# EAGLE schematic panel (EAGLE 6.6.0)

## Sheet 1 of 2
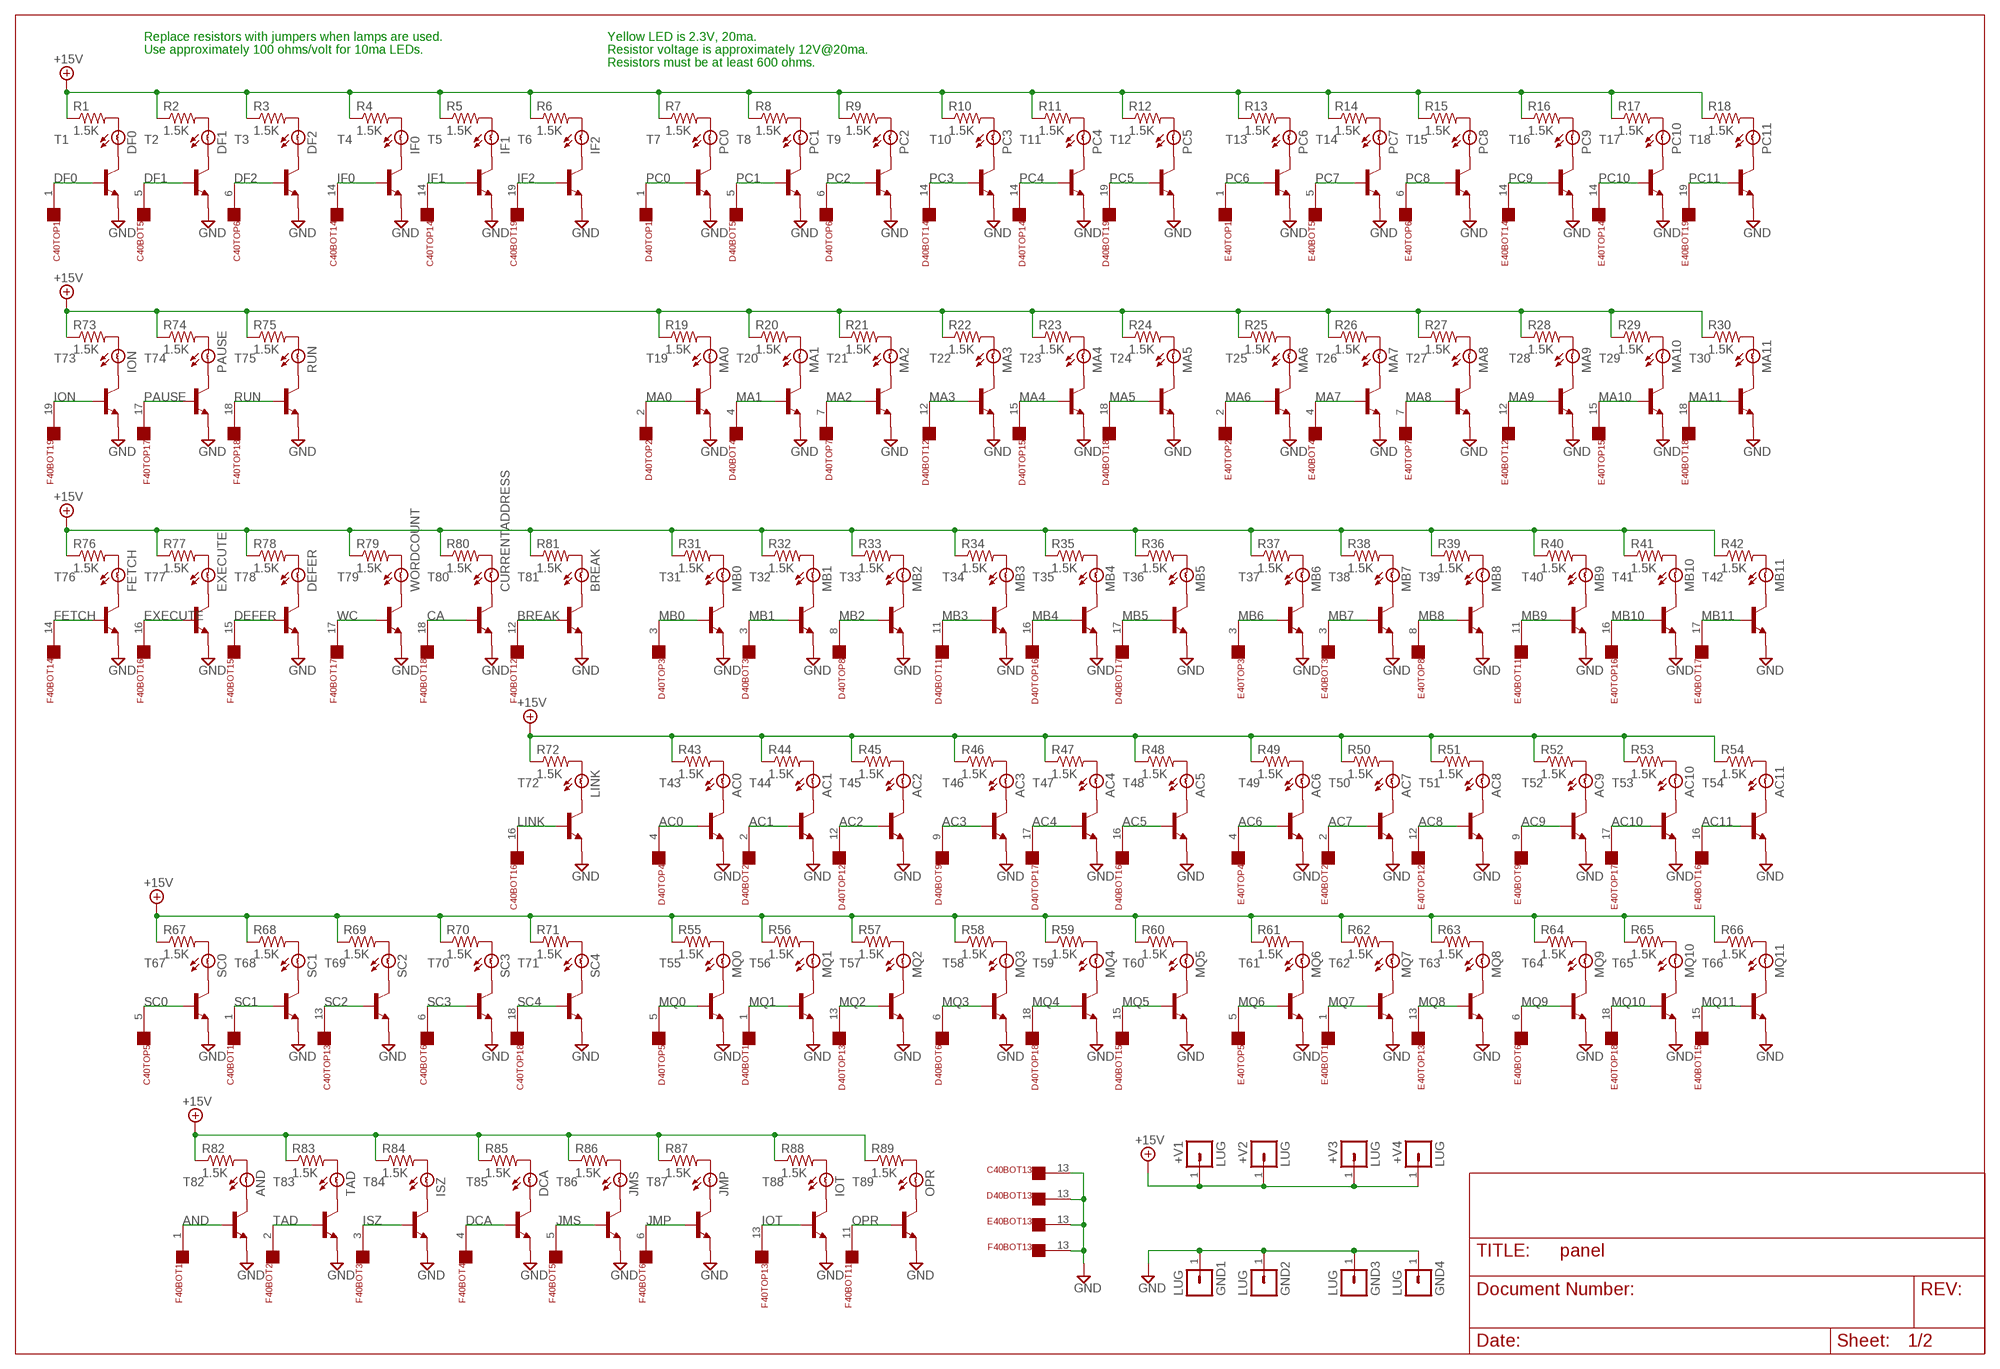
[diagram p0: schematic, sheet 1]

### Parts
+V1  LUG  [SPADELUG]
+V2  LUG  [SPADELUG]
+V3  LUG  [SPADELUG]
+V4  LUG  [SPADELUG]
AC0  BULB  [BULB]
AC1  BULB  [BULB]
AC2  BULB  [BULB]
AC3  BULB  [BULB]
AC4  BULB  [BULB]
AC5  BULB  [BULB]
AC6  BULB  [BULB]
AC7  BULB  [BULB]
AC8  BULB  [BULB]
AC9  BULB  [BULB]
AC10  BULB  [BULB]
AC11  BULB  [BULB]
AND  BULB  [BULB]
BREAK  BULB  [BULB]
C40BOT  FLEX19  [FLEX19]
C40TOP  FLEX19  [FLEX19]
CURRENTADDRESS  BULB  [BULB]
D40BOT  FLEX19  [FLEX19]
D40TOP  FLEX19  [FLEX19]
DCA  BULB  [BULB]
DEFER  BULB  [BULB]
DF0  BULB  [BULB]
DF1  BULB  [BULB]
DF2  BULB  [BULB]
E40BOT  FLEX19  [FLEX19]
E40TOP  FLEX19  [FLEX19]
EXECUTE  BULB  [BULB]
F40BOT  FLEX19  [FLEX19]
F40TOP  FLEX19  [FLEX19]
FETCH  BULB  [BULB]
GND1  LUG  [SPADELUG]
GND2  LUG  [SPADELUG]
GND3  LUG  [SPADELUG]
GND4  LUG  [SPADELUG]
IF0  BULB  [BULB]
IF1  BULB  [BULB]
IF2  BULB  [BULB]
ION  BULB  [BULB]
IOT  BULB  [BULB]
ISZ  BULB  [BULB]
JMP  BULB  [BULB]
JMS  BULB  [BULB]
LINK  BULB  [BULB]
MA0  BULB  [BULB]
MA1  BULB  [BULB]
MA2  BULB  [BULB]
MA3  BULB  [BULB]
MA4  BULB  [BULB]
MA5  BULB  [BULB]
MA6  BULB  [BULB]
MA7  BULB  [BULB]
MA8  BULB  [BULB]
MA9  BULB  [BULB]
MA10  BULB  [BULB]
MA11  BULB  [BULB]
MB0  BULB  [BULB]
MB1  BULB  [BULB]
MB2  BULB  [BULB]
MB3  BULB  [BULB]
MB4  BULB  [BULB]
MB5  BULB  [BULB]
MB6  BULB  [BULB]
MB7  BULB  [BULB]
MB8  BULB  [BULB]
MB9  BULB  [BULB]
MB10  BULB  [BULB]
MB11  BULB  [BULB]
MQ0  BULB  [BULB]
MQ1  BULB  [BULB]
MQ2  BULB  [BULB]
MQ3  BULB  [BULB]
MQ4  BULB  [BULB]
MQ5  BULB  [BULB]
MQ6  BULB  [BULB]
MQ7  BULB  [BULB]
MQ8  BULB  [BULB]
MQ9  BULB  [BULB]
MQ10  BULB  [BULB]
MQ11  BULB  [BULB]
OPR  BULB  [BULB]
PAUSE  BULB  [BULB]
PC0  BULB  [BULB]
PC1  BULB  [BULB]
PC2  BULB  [BULB]
PC3  BULB  [BULB]
PC4  BULB  [BULB]
PC5  BULB  [BULB]
PC6  BULB  [BULB]
PC7  BULB  [BULB]
PC8  BULB  [BULB]
PC9  BULB  [BULB]
PC10  BULB  [BULB]
PC11  BULB  [BULB]
R1  1.5K  R-US_0207/10  [0207/10]
R2  1.5K  R-US_0207/10  [0207/10]
R3  1.5K  R-US_0207/10  [0207/10]
R4  1.5K  R-US_0207/10  [0207/10]
R5  1.5K  R-US_0207/10  [0207/10]
R6  1.5K  R-US_0207/10  [0207/10]
R7  1.5K  R-US_0207/10  [0207/10]
R8  1.5K  R-US_0207/10  [0207/10]
R9  1.5K  R-US_0207/10  [0207/10]
R10  1.5K  R-US_0207/10  [0207/10]
R11  1.5K  R-US_0207/10  [0207/10]
R12  1.5K  R-US_0207/10  [0207/10]
R13  1.5K  R-US_0207/10  [0207/10]
R14  1.5K  R-US_0207/10  [0207/10]
R15  1.5K  R-US_0207/10  [0207/10]
R16  1.5K  R-US_0207/10  [0207/10]
R17  1.5K  R-US_0207/10  [0207/10]
R18  1.5K  R-US_0207/10  [0207/10]
R19  1.5K  R-US_0207/10  [0207/10]
R20  1.5K  R-US_0207/10  [0207/10]
R21  1.5K  R-US_0207/10  [0207/10]
R22  1.5K  R-US_0207/10  [0207/10]
R23  1.5K  R-US_0207/10  [0207/10]
R24  1.5K  R-US_0207/10  [0207/10]
R25  1.5K  R-US_0207/10  [0207/10]
R26  1.5K  R-US_0207/10  [0207/10]
R27  1.5K  R-US_0207/10  [0207/10]
R28  1.5K  R-US_0207/10  [0207/10]
R29  1.5K  R-US_0207/10  [0207/10]
R30  1.5K  R-US_0207/10  [0207/10]
R31  1.5K  R-US_0207/10  [0207/10]
R32  1.5K  R-US_0207/10  [0207/10]
R33  1.5K  R-US_0207/10  [0207/10]
R34  1.5K  R-US_0207/10  [0207/10]
R35  1.5K  R-US_0207/10  [0207/10]
R36  1.5K  R-US_0207/10  [0207/10]
R37  1.5K  R-US_0207/10  [0207/10]
R38  1.5K  R-US_0207/10  [0207/10]
R39  1.5K  R-US_0207/10  [0207/10]
R40  1.5K  R-US_0207/10  [0207/10]
R41  1.5K  R-US_0207/10  [0207/10]
R42  1.5K  R-US_0207/10  [0207/10]
R43  1.5K  R-US_0207/10  [0207/10]
R44  1.5K  R-US_0207/10  [0207/10]
R45  1.5K  R-US_0207/10  [0207/10]
R46  1.5K  R-US_0207/10  [0207/10]
R47  1.5K  R-US_0207/10  [0207/10]
R48  1.5K  R-US_0207/10  [0207/10]
R49  1.5K  R-US_0207/10  [0207/10]
R50  1.5K  R-US_0207/10  [0207/10]
R51  1.5K  R-US_0207/10  [0207/10]
R52  1.5K  R-US_0207/10  [0207/10]
R53  1.5K  R-US_0207/10  [0207/10]
R54  1.5K  R-US_0207/10  [0207/10]
R55  1.5K  R-US_0207/10  [0207/10]
R56  1.5K  R-US_0207/10  [0207/10]
R57  1.5K  R-US_0207/10  [0207/10]
R58  1.5K  R-US_0207/10  [0207/10]
R59  1.5K  R-US_0207/10  [0207/10]
R60  1.5K  R-US_0207/10  [0207/10]
R61  1.5K  R-US_0207/10  [0207/10]
R62  1.5K  R-US_0207/10  [0207/10]
R63  1.5K  R-US_0207/10  [0207/10]
R64  1.5K  R-US_0207/10  [0207/10]
R65  1.5K  R-US_0207/10  [0207/10]
R66  1.5K  R-US_0207/10  [0207/10]
R67  1.5K  R-US_0207/10  [0207/10]
R68  1.5K  R-US_0207/10  [0207/10]
R69  1.5K  R-US_0207/10  [0207/10]
R70  1.5K  R-US_0207/10  [0207/10]
R71  1.5K  R-US_0207/10  [0207/10]
R72  1.5K  R-US_0207/10  [0207/10]
R73  1.5K  R-US_0207/10  [0207/10]
R74  1.5K  R-US_0207/10  [0207/10]
R75  1.5K  R-US_0207/10  [0207/10]
R76  1.5K  R-US_0207/10  [0207/10]
R77  1.5K  R-US_0207/10  [0207/10]
R78  1.5K  R-US_0207/10  [0207/10]
R79  1.5K  R-US_0207/10  [0207/10]
R80  1.5K  R-US_0207/10  [0207/10]
R81  1.5K  R-US_0207/10  [0207/10]
R82  1.5K  R-US_0207/10  [0207/10]
R83  1.5K  R-US_0207/10  [0207/10]
R84  1.5K  R-US_0207/10  [0207/10]
R85  1.5K  R-US_0207/10  [0207/10]
R86  1.5K  R-US_0207/10  [0207/10]
R87  1.5K  R-US_0207/10  [0207/10]
R88  1.5K  R-US_0207/10  [0207/10]
R89  1.5K  R-US_0207/10  [0207/10]
RUN  BULB  [BULB]
SC0  BULB  [BULB]
SC1  BULB  [BULB]
SC2  BULB  [BULB]
SC3  BULB  [BULB]
SC4  BULB  [BULB]
T1  MPS2222A-NPN-TO92-CBE  [TO92-CBE]
T2  MPS2222A-NPN-TO92-CBE  [TO92-CBE]
T3  MPS2222A-NPN-TO92-CBE  [TO92-CBE]
T4  MPS2222A-NPN-TO92-CBE  [TO92-CBE]
T5  MPS2222A-NPN-TO92-CBE  [TO92-CBE]
T6  MPS2222A-NPN-TO92-CBE  [TO92-CBE]
T7  MPS2222A-NPN-TO92-CBE  [TO92-CBE]
T8  MPS2222A-NPN-TO92-CBE  [TO92-CBE]
T9  MPS2222A-NPN-TO92-CBE  [TO92-CBE]
T10  MPS2222A-NPN-TO92-CBE  [TO92-CBE]
T11  MPS2222A-NPN-TO92-CBE  [TO92-CBE]
T12  MPS2222A-NPN-TO92-CBE  [TO92-CBE]
T13  MPS2222A-NPN-TO92-CBE  [TO92-CBE]
T14  MPS2222A-NPN-TO92-CBE  [TO92-CBE]
T15  MPS2222A-NPN-TO92-CBE  [TO92-CBE]
T16  MPS2222A-NPN-TO92-CBE  [TO92-CBE]
T17  MPS2222A-NPN-TO92-CBE  [TO92-CBE]
T18  MPS2222A-NPN-TO92-CBE  [TO92-CBE]
T19  MPS2222A-NPN-TO92-CBE  [TO92-CBE]
T20  MPS2222A-NPN-TO92-CBE  [TO92-CBE]
T21  MPS2222A-NPN-TO92-CBE  [TO92-CBE]
T22  MPS2222A-NPN-TO92-CBE  [TO92-CBE]
T23  MPS2222A-NPN-TO92-CBE  [TO92-CBE]
T24  MPS2222A-NPN-TO92-CBE  [TO92-CBE]
T25  MPS2222A-NPN-TO92-CBE  [TO92-CBE]
T26  MPS2222A-NPN-TO92-CBE  [TO92-CBE]
T27  MPS2222A-NPN-TO92-CBE  [TO92-CBE]
T28  MPS2222A-NPN-TO92-CBE  [TO92-CBE]
T29  MPS2222A-NPN-TO92-CBE  [TO92-CBE]
T30  MPS2222A-NPN-TO92-CBE  [TO92-CBE]
T31  MPS2222A-NPN-TO92-CBE  [TO92-CBE]
T32  MPS2222A-NPN-TO92-CBE  [TO92-CBE]
T33  MPS2222A-NPN-TO92-CBE  [TO92-CBE]
T34  MPS2222A-NPN-TO92-CBE  [TO92-CBE]
T35  MPS2222A-NPN-TO92-CBE  [TO92-CBE]
T36  MPS2222A-NPN-TO92-CBE  [TO92-CBE]
T37  MPS2222A-NPN-TO92-CBE  [TO92-CBE]
T38  MPS2222A-NPN-TO92-CBE  [TO92-CBE]
T39  MPS2222A-NPN-TO92-CBE  [TO92-CBE]
T40  MPS2222A-NPN-TO92-CBE  [TO92-CBE]
T41  MPS2222A-NPN-TO92-CBE  [TO92-CBE]
T42  MPS2222A-NPN-TO92-CBE  [TO92-CBE]
T43  MPS2222A-NPN-TO92-CBE  [TO92-CBE]
T44  MPS2222A-NPN-TO92-CBE  [TO92-CBE]
T45  MPS2222A-NPN-TO92-CBE  [TO92-CBE]
T46  MPS2222A-NPN-TO92-CBE  [TO92-CBE]
T47  MPS2222A-NPN-TO92-CBE  [TO92-CBE]
T48  MPS2222A-NPN-TO92-CBE  [TO92-CBE]
T49  MPS2222A-NPN-TO92-CBE  [TO92-CBE]
T50  MPS2222A-NPN-TO92-CBE  [TO92-CBE]
T51  MPS2222A-NPN-TO92-CBE  [TO92-CBE]
T52  MPS2222A-NPN-TO92-CBE  [TO92-CBE]
T53  MPS2222A-NPN-TO92-CBE  [TO92-CBE]
T54  MPS2222A-NPN-TO92-CBE  [TO92-CBE]
T55  MPS2222A-NPN-TO92-CBE  [TO92-CBE]
T56  MPS2222A-NPN-TO92-CBE  [TO92-CBE]
T57  MPS2222A-NPN-TO92-CBE  [TO92-CBE]
T58  MPS2222A-NPN-TO92-CBE  [TO92-CBE]
T59  MPS2222A-NPN-TO92-CBE  [TO92-CBE]
T60  MPS2222A-NPN-TO92-CBE  [TO92-CBE]
T61  MPS2222A-NPN-TO92-CBE  [TO92-CBE]
T62  MPS2222A-NPN-TO92-CBE  [TO92-CBE]
T63  MPS2222A-NPN-TO92-CBE  [TO92-CBE]
T64  MPS2222A-NPN-TO92-CBE  [TO92-CBE]
T65  MPS2222A-NPN-TO92-CBE  [TO92-CBE]
T66  MPS2222A-NPN-TO92-CBE  [TO92-CBE]
T67  MPS2222A-NPN-TO92-CBE  [TO92-CBE]
T68  MPS2222A-NPN-TO92-CBE  [TO92-CBE]
T69  MPS2222A-NPN-TO92-CBE  [TO92-CBE]
T70  MPS2222A-NPN-TO92-CBE  [TO92-CBE]
T71  MPS2222A-NPN-TO92-CBE  [TO92-CBE]
T72  MPS2222A-NPN-TO92-CBE  [TO92-CBE]
T73  MPS2222A-NPN-TO92-CBE  [TO92-CBE]
T74  MPS2222A-NPN-TO92-CBE  [TO92-CBE]
T75  MPS2222A-NPN-TO92-CBE  [TO92-CBE]
T76  MPS2222A-NPN-TO92-CBE  [TO92-CBE]
T77  MPS2222A-NPN-TO92-CBE  [TO92-CBE]
T78  MPS2222A-NPN-TO92-CBE  [TO92-CBE]
T79  MPS2222A-NPN-TO92-CBE  [TO92-CBE]
T80  MPS2222A-NPN-TO92-CBE  [TO92-CBE]
T81  MPS2222A-NPN-TO92-CBE  [TO92-CBE]
T82  MPS2222A-NPN-TO92-CBE  [TO92-CBE]
T83  MPS2222A-NPN-TO92-CBE  [TO92-CBE]
T84  MPS2222A-NPN-TO92-CBE  [TO92-CBE]
T85  MPS2222A-NPN-TO92-CBE  [TO92-CBE]
T86  MPS2222A-NPN-TO92-CBE  [TO92-CBE]
T87  MPS2222A-NPN-TO92-CBE  [TO92-CBE]
T88  MPS2222A-NPN-TO92-CBE  [TO92-CBE]
T89  MPS2222A-NPN-TO92-CBE  [TO92-CBE]
TAD  BULB  [BULB]
WORDCOUNT  BULB  [BULB]

### Nets
+15V [supply]: +V1.1 +V2.1 +V3.1 +V4.1 R1.1 R2.1 R3.1 R4.1 R5.1 R6.1 R7.1 R8.1 R9.1 R10.1 R11.1 R12.1 R13.1 R14.1 R15.1 R16.1 R17.1 R18.1 R19.1 R20.1 R21.1 R22.1 R23.1 R24.1 R25.1 R26.1 R27.1 R28.1 R29.1 R30.1 R31.1 R32.1 R33.1 R34.1 R35.1 R36.1 R37.1 R38.1 R39.1 R40.1 R41.1 R42.1 R43.1 R44.1 R45.1 R46.1 R47.1 R48.1 R49.1 R50.1 R51.1 R52.1 R53.1 R54.1 R55.1 R56.1 R57.1 R58.1 R59.1 R60.1 R61.1 R62.1 R63.1 R64.1 R65.1 R66.1 R67.1 R68.1 R69.1 R70.1 R71.1 R72.1 R73.1 R74.1 R75.1 R76.1 R77.1 R78.1 R79.1 R80.1 R81.1 R82.1 R83.1 R84.1 R85.1 R86.1 R87.1 R88.1 R89.1
AC0: D40TOP.4 T43.B ; also sheet 2
AC1: D40BOT.2 T44.B ; also sheet 2
AC2: D40TOP.12 T45.B ; also sheet 2
AC3: D40BOT.9 T46.B ; also sheet 2
AC4: D40TOP.17 T47.B ; also sheet 2
AC5: D40BOT.16 T48.B ; also sheet 2
AC6: E40TOP.4 T49.B ; also sheet 2
AC7: E40BOT.2 T50.B ; also sheet 2
AC8: E40TOP.12 T51.B ; also sheet 2
AC9: E40BOT.9 T52.B ; also sheet 2
AC10: E40TOP.17 T53.B ; also sheet 2
AC11: E40BOT.16 T54.B ; also sheet 2
AND: F40BOT.1 T82.B ; also sheet 2
BREAK: F40BOT.12 T81.B ; also sheet 2
CA: F40BOT.18 T80.B ; also sheet 2
DCA: F40BOT.4 T85.B ; also sheet 2
DEFER: F40BOT.15 T78.B ; also sheet 2
DF0: C40TOP.1 T1.B ; also sheet 2
DF1: C40BOT.5 T2.B ; also sheet 2
DF2: C40TOP.6 T3.B ; also sheet 2
EXECUTE: F40BOT.16 T77.B ; also sheet 2
FETCH: F40BOT.14 T76.B ; also sheet 2
GND [supply]: C40BOT.13 D40BOT.13 E40BOT.13 F40BOT.13 GND1.1 GND2.1 GND3.1 GND4.1 T1.E T2.E T3.E T4.E T5.E T6.E T7.E T8.E T9.E T10.E T11.E T12.E T13.E T14.E T15.E T16.E T17.E T18.E T19.E T20.E T21.E T22.E T23.E T24.E T25.E T26.E T27.E T28.E T29.E T30.E T31.E T32.E T33.E T34.E T35.E T36.E T37.E T38.E T39.E T40.E T41.E T42.E T43.E T44.E T45.E T46.E T47.E T48.E T49.E T50.E T51.E T52.E T53.E T54.E T55.E T56.E T57.E T58.E T59.E T60.E T61.E T62.E T63.E T64.E T65.E T66.E T67.E T68.E T69.E T70.E T71.E T72.E T73.E T74.E T75.E T76.E T77.E T78.E T79.E T80.E T81.E T82.E T83.E T84.E T85.E T86.E T87.E T88.E T89.E ; also sheet 2
IF0: C40BOT.14 T4.B ; also sheet 2
IF1: C40TOP.14 T5.B ; also sheet 2
IF2: C40BOT.19 T6.B ; also sheet 2
ION: F40BOT.19 T73.B ; also sheet 2
IOT: F40TOP.13 T88.B ; also sheet 2
ISZ: F40BOT.3 T84.B ; also sheet 2
JMP: F40BOT.6 T87.B ; also sheet 2
JMS: F40BOT.5 T86.B ; also sheet 2
LINK: C40BOT.16 T72.B ; also sheet 2
MA0: D40TOP.2 T19.B ; also sheet 2
MA1: D40BOT.4 T20.B ; also sheet 2
MA2: D40TOP.7 T21.B ; also sheet 2
MA3: D40BOT.12 T22.B ; also sheet 2
MA4: D40TOP.15 T23.B ; also sheet 2
MA5: D40BOT.18 T24.B ; also sheet 2
MA6: E40TOP.2 T25.B ; also sheet 2
MA7: E40BOT.4 T26.B ; also sheet 2
MA8: E40TOP.7 T27.B ; also sheet 2
MA9: E40BOT.12 T28.B ; also sheet 2
MA10: E40TOP.15 T29.B ; also sheet 2
MA11: E40BOT.18 T30.B ; also sheet 2
MB0: D40TOP.3 T31.B ; also sheet 2
MB1: D40BOT.3 T32.B ; also sheet 2
MB2: D40TOP.8 T33.B ; also sheet 2
MB3: D40BOT.11 T34.B ; also sheet 2
MB4: D40TOP.16 T35.B ; also sheet 2
MB5: D40BOT.17 T36.B ; also sheet 2
MB6: E40TOP.3 T37.B ; also sheet 2
MB7: E40BOT.3 T38.B ; also sheet 2
MB8: E40TOP.8 T39.B ; also sheet 2
MB9: E40BOT.11 T40.B ; also sheet 2
MB10: E40TOP.16 T41.B ; also sheet 2
MB11: E40BOT.17 T42.B ; also sheet 2
MQ0: D40TOP.5 T55.B ; also sheet 2
MQ1: D40BOT.1 T56.B ; also sheet 2
MQ2: D40TOP.13 T57.B ; also sheet 2
MQ3: D40BOT.6 T58.B ; also sheet 2
MQ4: D40TOP.18 T59.B ; also sheet 2
MQ5: D40BOT.15 T60.B ; also sheet 2
MQ6: E40TOP.5 T61.B ; also sheet 2
MQ7: E40BOT.1 T62.B ; also sheet 2
MQ8: E40TOP.13 T63.B ; also sheet 2
MQ9: E40BOT.6 T64.B ; also sheet 2
MQ10: E40TOP.18 T65.B ; also sheet 2
MQ11: E40BOT.15 T66.B ; also sheet 2
N$1: DF0.B T1.C
N$2: DF1.B T2.C
N$3: DF2.B T3.C
N$4: IF0.B T4.C
N$5: IF1.B T5.C
N$6: IF2.B T6.C
N$7: PC0.B T7.C
N$8: PC1.B T8.C
N$9: PC2.B T9.C
N$10: PC3.B T10.C
N$11: PC4.B T11.C
N$12: PC5.B T12.C
N$13: PC6.B T13.C
N$14: PC7.B T14.C
N$15: PC8.B T15.C
N$16: PC9.B T16.C
N$17: PC10.B T17.C
N$18: PC11.B T18.C
N$19: MA0.B T19.C
N$20: MA1.B T20.C
N$21: MA2.B T21.C
N$22: MA3.B T22.C
N$23: MA4.B T23.C
N$24: MA5.B T24.C
N$25: MA6.B T25.C
N$26: MA7.B T26.C
N$27: MA8.B T27.C
N$28: MA9.B T28.C
N$29: MA10.B T29.C
N$30: MA11.B T30.C
N$31: MB0.B T31.C
N$32: MB1.B T32.C
N$33: MB2.B T33.C
N$34: MB3.B T34.C
N$35: MB4.B T35.C
N$36: MB5.B T36.C
N$37: MB6.B T37.C
N$38: MB7.B T38.C
N$39: MB8.B T39.C
N$40: MB9.B T40.C
N$41: MB10.B T41.C
N$42: MB11.B T42.C
N$43: AC0.B T43.C
N$44: AC1.B T44.C
N$45: AC2.B T45.C
N$46: AC3.B T46.C
N$47: AC4.B T47.C
N$48: AC5.B T48.C
N$49: AC6.B T49.C
N$50: AC7.B T50.C
N$51: AC8.B T51.C
N$52: AC9.B T52.C
N$53: AC10.B T53.C
N$54: AC11.B T54.C
N$55: MQ0.B T55.C
N$56: MQ1.B T56.C
N$57: MQ2.B T57.C
N$58: MQ3.B T58.C
N$59: MQ4.B T59.C
N$60: MQ5.B T60.C
N$61: MQ6.B T61.C
N$62: MQ7.B T62.C
N$63: MQ8.B T63.C
N$64: MQ9.B T64.C
N$65: MQ10.B T65.C
N$66: MQ11.B T66.C
N$67: SC0.B T67.C
N$68: SC1.B T68.C
N$69: SC2.B T69.C
N$70: SC3.B T70.C
N$71: SC4.B T71.C
N$72: LINK.B T72.C
N$73: ION.B T73.C
N$74: PAUSE.B T74.C
N$75: RUN.B T75.C
N$76: FETCH.B T76.C
N$77: EXECUTE.B T77.C
N$78: DEFER.B T78.C
N$79: T79.C WORDCOUNT.B
N$80: CURRENTADDRESS.B T80.C
N$81: BREAK.B T81.C
N$82: AND.B T82.C
N$83: T83.C TAD.B
N$84: ISZ.B T84.C
N$85: DCA.B T85.C
N$86: JMS.B T86.C
N$87: JMP.B T87.C
N$88: IOT.B T88.C
N$89: OPR.B T89.C
N$90: DF0.A R1.2
N$91: DF1.A R2.2
N$92: DF2.A R3.2
N$93: IF0.A R4.2
N$94: IF1.A R5.2
N$95: IF2.A R6.2
N$96: PC0.A R7.2
N$97: PC1.A R8.2
N$98: PC2.A R9.2
N$99: PC3.A R10.2
N$100: PC4.A R11.2
N$101: PC5.A R12.2
N$102: PC6.A R13.2
N$103: PC7.A R14.2
N$104: PC8.A R15.2
N$105: PC9.A R16.2
N$106: PC10.A R17.2
N$107: PC11.A R18.2
N$108: ION.A R73.2
N$109: PAUSE.A R74.2
N$110: R75.2 RUN.A
N$111: MA0.A R19.2
N$112: MA1.A R20.2
N$113: MA2.A R21.2
N$114: MA3.A R22.2
N$115: MA4.A R23.2
N$116: MA5.A R24.2
N$117: MA6.A R25.2
N$118: MA7.A R26.2
N$119: MA8.A R27.2
N$120: MA9.A R28.2
N$121: MA10.A R29.2
N$122: MA11.A R30.2
N$123: FETCH.A R76.2
N$124: EXECUTE.A R77.2
N$125: DEFER.A R78.2
N$126: R79.2 WORDCOUNT.A
N$127: CURRENTADDRESS.A R80.2
N$128: BREAK.A R81.2
N$129: LINK.A R72.2
N$130: MB0.A R31.2
N$131: MB1.A R32.2
N$132: MB2.A R33.2
N$133: MB3.A R34.2
N$134: MB4.A R35.2
N$135: MB5.A R36.2
N$136: MB6.A R37.2
N$137: MB7.A R38.2
N$138: MB8.A R39.2
N$139: MB9.A R40.2
N$140: MB10.A R41.2
N$141: MB11.A R42.2
N$142: AC0.A R43.2
N$143: AC1.A R44.2
N$144: AC2.A R45.2
N$145: AC3.A R46.2
N$146: AC4.A R47.2
N$147: AC5.A R48.2
N$148: AC6.A R49.2
N$149: AC7.A R50.2
N$150: AC8.A R51.2
N$151: AC9.A R52.2
N$152: AC10.A R53.2
N$153: AC11.A R54.2
N$154: R67.2 SC0.A
N$155: R68.2 SC1.A
N$156: R69.2 SC2.A
N$157: R70.2 SC3.A
N$158: R71.2 SC4.A
N$159: MQ11.A R66.2
N$160: MQ10.A R65.2
N$161: MQ9.A R64.2
N$162: MQ8.A R63.2
N$163: MQ7.A R62.2
N$164: MQ6.A R61.2
N$165: MQ5.A R60.2
N$166: MQ4.A R59.2
N$167: MQ3.A R58.2
N$168: MQ2.A R57.2
N$169: MQ1.A R56.2
N$170: MQ0.A R55.2
N$171: AND.A R82.2
N$172: R83.2 TAD.A
N$173: ISZ.A R84.2
N$174: DCA.A R85.2
N$175: JMS.A R86.2
N$176: JMP.A R87.2
N$177: IOT.A R88.2
N$178: OPR.A R89.2
OPR: F40BOT.11 T89.B ; also sheet 2
PAUSE: F40TOP.17 T74.B ; also sheet 2
PC0: D40TOP.1 T7.B ; also sheet 2
PC1: D40BOT.5 T8.B ; also sheet 2
PC2: D40TOP.6 T9.B ; also sheet 2
PC3: D40BOT.14 T10.B ; also sheet 2
PC4: D40TOP.14 T11.B ; also sheet 2
PC5: D40BOT.19 T12.B ; also sheet 2
PC6: E40TOP.1 T13.B ; also sheet 2
PC7: E40BOT.5 T14.B ; also sheet 2
PC8: E40TOP.6 T15.B ; also sheet 2
PC9: E40BOT.14 T16.B ; also sheet 2
PC10: E40TOP.14 T17.B ; also sheet 2
PC11: E40BOT.19 T18.B ; also sheet 2
RUN: F40TOP.18 T75.B ; also sheet 2
SC0: C40TOP.5 T67.B ; also sheet 2
SC1: C40BOT.1 T68.B ; also sheet 2
SC2: C40TOP.13 T69.B ; also sheet 2
SC3: C40BOT.6 T70.B ; also sheet 2
SC4: C40TOP.18 T71.B ; also sheet 2
TAD: F40BOT.2 T83.B ; also sheet 2
WC: F40BOT.17 T79.B ; also sheet 2
Unconnected: C40BOT.2 C40BOT.3 C40BOT.4 C40BOT.7 C40BOT.8 C40BOT.9 C40BOT.10 C40BOT.11 C40BOT.12 C40BOT.15 C40BOT.17 C40BOT.18 C40TOP.2 C40TOP.3 C40TOP.4 C40TOP.7 C40TOP.8 C40TOP.9 C40TOP.10 C40TOP.11 C40TOP.12 C40TOP.15 C40TOP.16 C40TOP.17 C40TOP.19 D40BOT.7 D40BOT.8 D40BOT.10 D40TOP.9 D40TOP.10 D40TOP.11 D40TOP.19 E40BOT.7 E40BOT.8 E40BOT.10 E40TOP.9 E40TOP.10 E40TOP.11 E40TOP.19 F40BOT.7 F40BOT.8 F40BOT.9 F40BOT.10 F40TOP.1 F40TOP.2 F40TOP.3 F40TOP.4 F40TOP.5 F40TOP.6 F40TOP.7 F40TOP.8 F40TOP.9 F40TOP.10 F40TOP.11 F40TOP.12 F40TOP.14 F40TOP.15 F40TOP.16 F40TOP.19

### Notes on the sheet
- Replace resistors with jumpers when lamps are used. | Yellow LED is 2.3V, 20ma.
- Use approximately 100 ohms/volt for 10ma LEDs. | Resistor voltage is approximately 12V@20ma.
- Resistors must be at least 600 ohms.

## Sheet 2 of 2
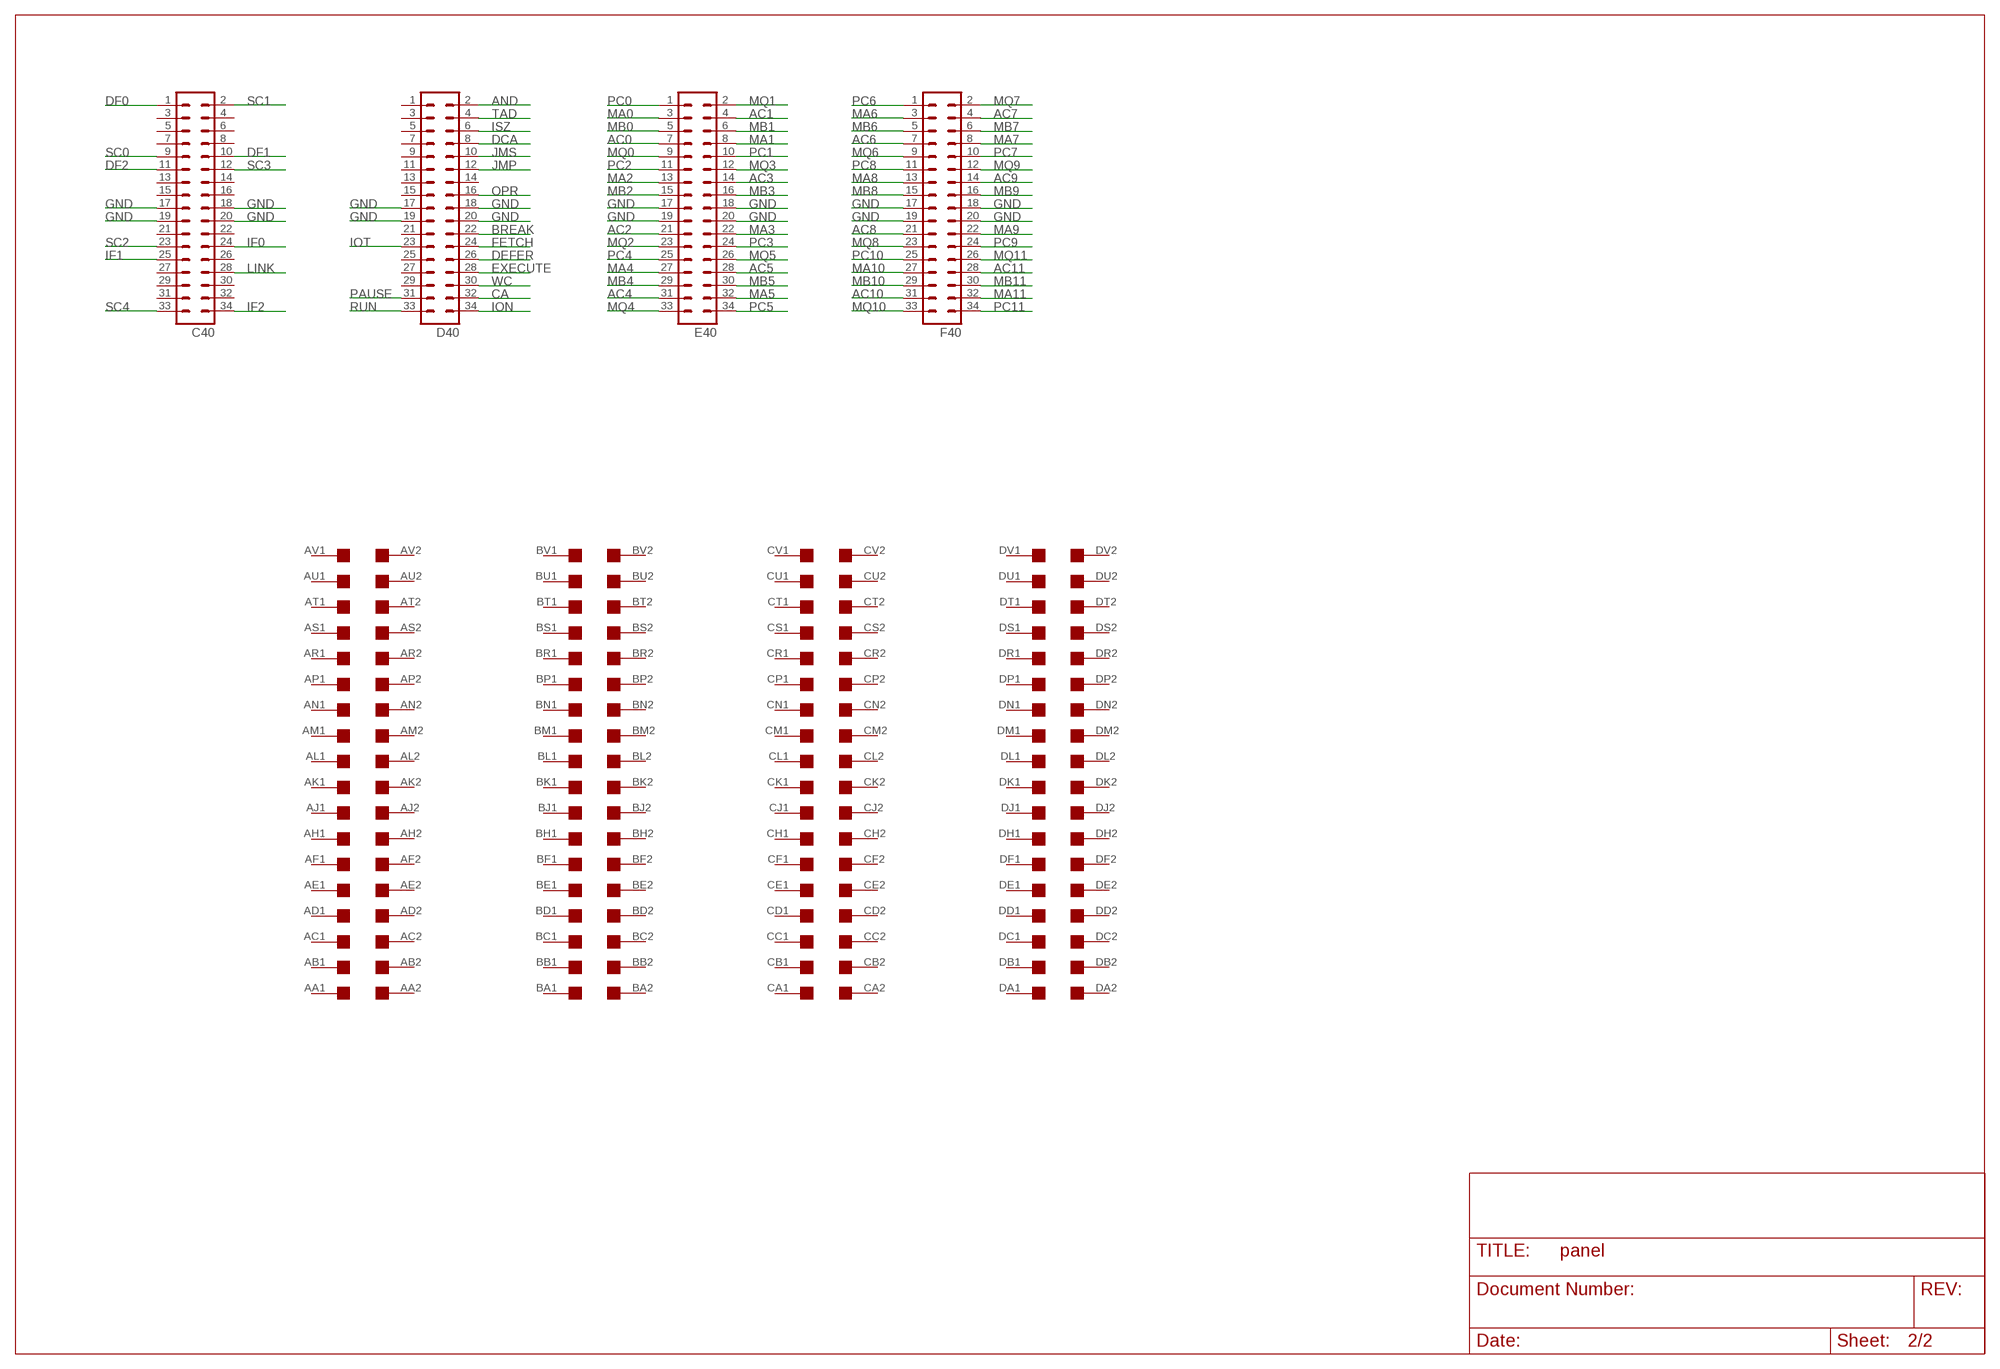
[diagram p1: schematic, sheet 2]

### Parts
C40  MA17-2  [MA17-2]
D40  MA17-2  [MA17-2]
E40  MA17-2  [MA17-2]
F40  MA17-2  [MA17-2]
U$10  QUAD  [EDGE-CON8]

### Nets
AC0: E40.7 ; also sheet 1
AC1: E40.4 ; also sheet 1
AC2: E40.21 ; also sheet 1
AC3: E40.14 ; also sheet 1
AC4: E40.31 ; also sheet 1
AC5: E40.28 ; also sheet 1
AC6: F40.7 ; also sheet 1
AC7: F40.4 ; also sheet 1
AC8: F40.21 ; also sheet 1
AC9: F40.14 ; also sheet 1
AC10: F40.31 ; also sheet 1
AC11: F40.28 ; also sheet 1
AND: D40.2 ; also sheet 1
BREAK: D40.22 ; also sheet 1
CA: D40.32 ; also sheet 1
DCA: D40.8 ; also sheet 1
DEFER: D40.26 ; also sheet 1
DF0: C40.1 ; also sheet 1
DF1: C40.10 ; also sheet 1
DF2: C40.11 ; also sheet 1
EXECUTE: D40.28 ; also sheet 1
FETCH: D40.24 ; also sheet 1
GND [supply]: C40.17 C40.18 C40.19 C40.20 D40.17 D40.18 D40.19 D40.20 E40.17 E40.18 E40.19 E40.20 F40.17 F40.18 F40.19 F40.20 ; also sheet 1
IF0: C40.24 ; also sheet 1
IF1: C40.25 ; also sheet 1
IF2: C40.34 ; also sheet 1
ION: D40.34 ; also sheet 1
IOT: D40.23 ; also sheet 1
ISZ: D40.6 ; also sheet 1
JMP: D40.12 ; also sheet 1
JMS: D40.10 ; also sheet 1
LINK: C40.28 ; also sheet 1
MA0: E40.3 ; also sheet 1
MA1: E40.8 ; also sheet 1
MA2: E40.13 ; also sheet 1
MA3: E40.22 ; also sheet 1
MA4: E40.27 ; also sheet 1
MA5: E40.32 ; also sheet 1
MA6: F40.3 ; also sheet 1
MA7: F40.8 ; also sheet 1
MA8: F40.13 ; also sheet 1
MA9: F40.22 ; also sheet 1
MA10: F40.27 ; also sheet 1
MA11: F40.32 ; also sheet 1
MB0: E40.5 ; also sheet 1
MB1: E40.6 ; also sheet 1
MB2: E40.15 ; also sheet 1
MB3: E40.16 ; also sheet 1
MB4: E40.29 ; also sheet 1
MB5: E40.30 ; also sheet 1
MB6: F40.5 ; also sheet 1
MB7: F40.6 ; also sheet 1
MB8: F40.15 ; also sheet 1
MB9: F40.16 ; also sheet 1
MB10: F40.29 ; also sheet 1
MB11: F40.30 ; also sheet 1
MQ0: E40.9 ; also sheet 1
MQ1: E40.2 ; also sheet 1
MQ2: E40.23 ; also sheet 1
MQ3: E40.12 ; also sheet 1
MQ4: E40.33 ; also sheet 1
MQ5: E40.26 ; also sheet 1
MQ6: F40.9 ; also sheet 1
MQ7: F40.2 ; also sheet 1
MQ8: F40.23 ; also sheet 1
MQ9: F40.12 ; also sheet 1
MQ10: F40.33 ; also sheet 1
MQ11: F40.26 ; also sheet 1
OPR: D40.16 ; also sheet 1
PAUSE: D40.31 ; also sheet 1
PC0: E40.1 ; also sheet 1
PC1: E40.10 ; also sheet 1
PC2: E40.11 ; also sheet 1
PC3: E40.24 ; also sheet 1
PC4: E40.25 ; also sheet 1
PC5: E40.34 ; also sheet 1
PC6: F40.1 ; also sheet 1
PC7: F40.10 ; also sheet 1
PC8: F40.11 ; also sheet 1
PC9: F40.24 ; also sheet 1
PC10: F40.25 ; also sheet 1
PC11: F40.34 ; also sheet 1
RUN: D40.33 ; also sheet 1
SC0: C40.9 ; also sheet 1
SC1: C40.2 ; also sheet 1
SC2: C40.23 ; also sheet 1
SC3: C40.12 ; also sheet 1
SC4: C40.33 ; also sheet 1
TAD: D40.4 ; also sheet 1
WC: D40.30 ; also sheet 1
Unconnected: C40.3 C40.4 C40.5 C40.6 C40.7 C40.8 C40.13 C40.14 C40.15 C40.16 C40.21 C40.22 C40.26 C40.27 C40.29 C40.30 C40.31 C40.32 D40.1 D40.3 D40.5 D40.7 D40.9 D40.11 D40.13 D40.14 D40.15 D40.21 D40.25 D40.27 D40.29 U$10.AA1 U$10.AA2 U$10.AB1 U$10.AB2 U$10.AC1 U$10.AC2 U$10.AD1 U$10.AD2 U$10.AE1 U$10.AE2 U$10.AF1 U$10.AF2 U$10.AH1 U$10.AH2 U$10.AJ1 U$10.AJ2 U$10.AK1 U$10.AK2 U$10.AL1 U$10.AL2 U$10.AM1 U$10.AM2 U$10.AN1 U$10.AN2 U$10.AP1 U$10.AP2 U$10.AR1 U$10.AR2 U$10.AS1 U$10.AS2 U$10.AT1 U$10.AT2 U$10.AU1 U$10.AU2 U$10.AV1 U$10.AV2 U$10.BA1 U$10.BA2 U$10.BB1 U$10.BB2 U$10.BC1 U$10.BC2 U$10.BD1 U$10.BD2 U$10.BE1 U$10.BE2 U$10.BF1 U$10.BF2 U$10.BH1 U$10.BH2 U$10.BJ1 U$10.BJ2 U$10.BK1 U$10.BK2 U$10.BL1 U$10.BL2 U$10.BM1 U$10.BM2 U$10.BN1 U$10.BN2 U$10.BP1 U$10.BP2 U$10.BR1 U$10.BR2 U$10.BS1 U$10.BS2 U$10.BT1 U$10.BT2 U$10.BU1 U$10.BU2 U$10.BV1 U$10.BV2 U$10.CA1 U$10.CA2 U$10.CB1 U$10.CB2 U$10.CC1 U$10.CC2 U$10.CD1 U$10.CD2 U$10.CE1 U$10.CE2 U$10.CF1 U$10.CF2 U$10.CH1 U$10.CH2 U$10.CJ1 U$10.CJ2 U$10.CK1 U$10.CK2 U$10.CL1 U$10.CL2 U$10.CM1 U$10.CM2 U$10.CN1 U$10.CN2 U$10.CP1 U$10.CP2 U$10.CR1 U$10.CR2 U$10.CS1 U$10.CS2 U$10.CT1 U$10.CT2 U$10.CU1 U$10.CU2 U$10.CV1 U$10.CV2 U$10.DA1 U$10.DA2 U$10.DB1 U$10.DB2 U$10.DC1 U$10.DC2 U$10.DD1 U$10.DD2 U$10.DE1 U$10.DE2 U$10.DF1 U$10.DF2 U$10.DH1 U$10.DH2 U$10.DJ1 U$10.DJ2 U$10.DK1 U$10.DK2 U$10.DL1 U$10.DL2 U$10.DM1 U$10.DM2 U$10.DN1 U$10.DN2 U$10.DP1 U$10.DP2 U$10.DR1 U$10.DR2 U$10.DS1 U$10.DS2 U$10.DT1 U$10.DT2 U$10.DU1 U$10.DU2 U$10.DV1 U$10.DV2

## Library data of the parts
+V1-+V4 GND1-GND4 = dec-con:LUG: Spade Lug
AC0 AC1-AC11 AND BREAK CURRENTADDRESS DCA DEFER DF0 DF1 DF2 EXECUTE FETCH IF0 IF1 IF2 ION IOT ISZ JMP JMS LINK MA0 MA1-MA11 MB0 MB1-MB11 MQ0 MQ1-MQ11 OPR PAUSE PC0 PC1-PC11 RUN SC0 SC1-SC4 TAD WORDCOUNT = dec-con:BULB: T 1 3/4 Bulb
C40 D40 E40 F40 = con-lstb:MA17-2: PIN HEADER; OC_FARNELL: unknown; OC_NEWARK: unknown
C40BOT C40TOP D40BOT D40TOP E40BOT E40TOP F40BOT F40TOP = dec-con:FLEX19: 19 pin Flexprint Connection
R1-R89 = rcl:R-US_: RESISTOR, American symbol
T1-T89 = transistor:*-NPN-: NPN Transistror BF959 corrected 2008.03.06
U$10 = dec-con:QUAD: Quad-Height DEC board

## Net classes
1 supply: width 0.813 mm